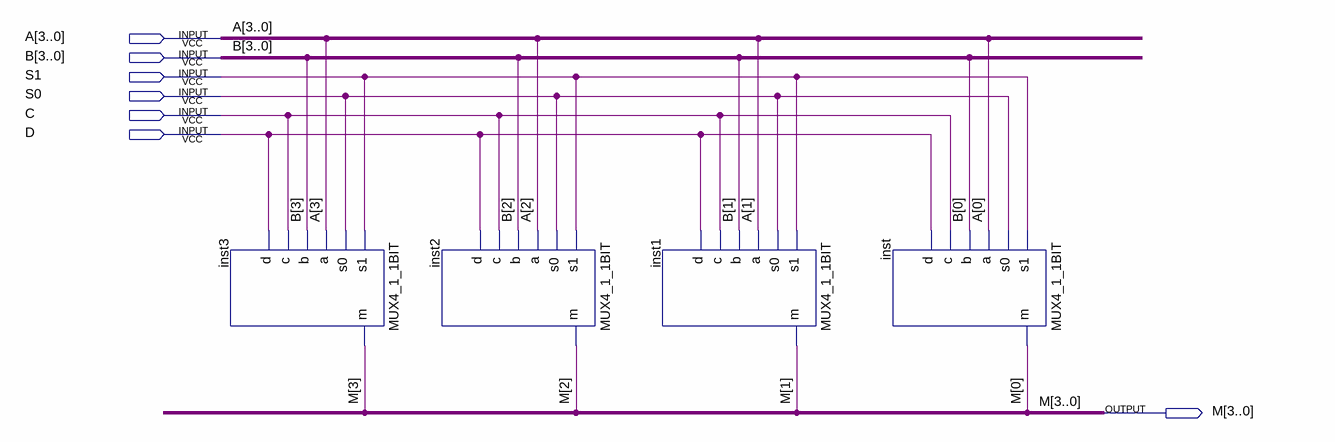
[diagram p0: schematic sheet]
// Quartus schematic MUX4_1_4BIT.bdf as structural Verilog: 4 symbols, 7 pins
module MUX4_1_4BIT (
  input  [3:0] A,
  input  [3:0] B,
  input  S1,
  input  S0,
  input  C,
  input  D,
  output [3:0] M
);

  MUX4_1_1BIT inst3 (.s1(S1), .s0(S0), .a(A[3]), .b(B[3]), .c(C), .d(D), .m(M[3]));
  MUX4_1_1BIT inst2 (.s1(S1), .s0(S0), .a(A[2]), .b(B[2]), .c(C), .d(D), .m(M[2]));
  MUX4_1_1BIT inst1 (.s1(S1), .s0(S0), .a(A[1]), .b(B[1]), .c(C), .d(D), .m(M[1]));
  MUX4_1_1BIT inst (.s1(S1), .s0(S0), .a(A[0]), .b(B[0]), .c(C), .d(D), .m(M[0]));
endmodule
